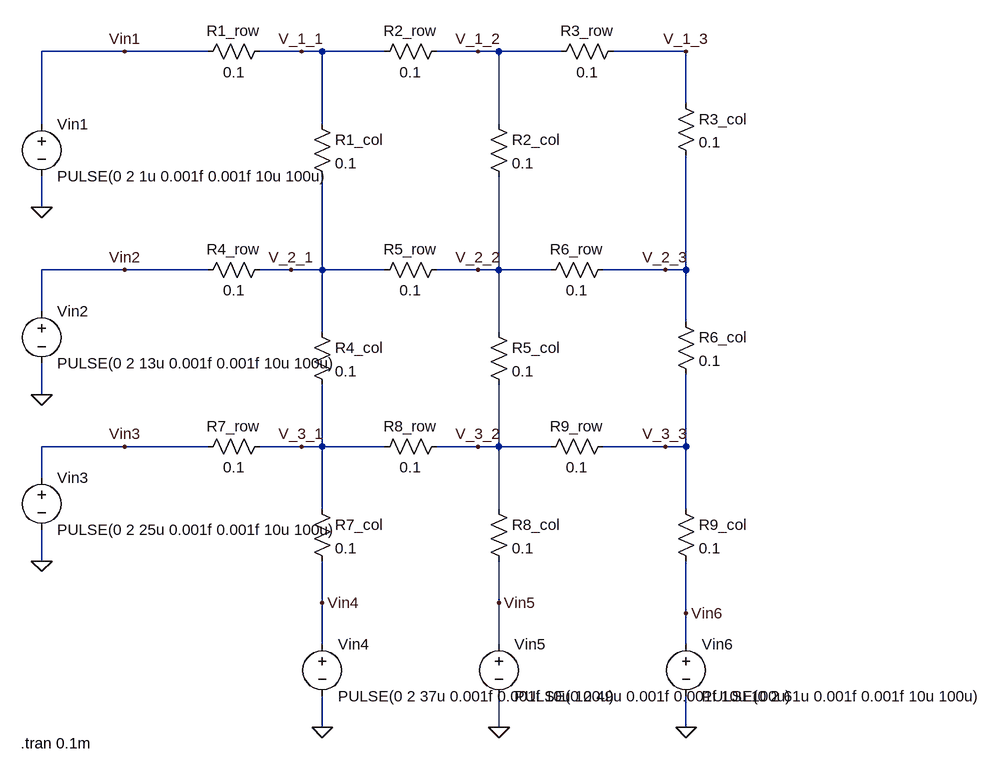
[diagram p0: schematic Memristor_modelling.asc]
Memristor_modelling.asc, the LTspice schematic file:
Version 4
SHEET 1 1428 920
WIRE 48 -160 -80 -160
WIRE 176 -160 48 -160
WIRE 320 -160 256 -160
WIRE 352 -160 320 -160
WIRE 448 -160 352 -160
WIRE 592 -160 528 -160
WIRE 624 -160 592 -160
WIRE 720 -160 624 -160
WIRE 912 -160 800 -160
WIRE 912 -80 912 -160
WIRE -80 -48 -80 -160
WIRE 352 -48 352 -160
WIRE 624 -48 624 -160
WIRE -80 80 -80 32
WIRE 48 176 -80 176
WIRE 176 176 48 176
WIRE 304 176 256 176
WIRE 352 176 352 32
WIRE 352 176 304 176
WIRE 448 176 352 176
WIRE 592 176 528 176
WIRE 624 176 624 32
WIRE 624 176 592 176
WIRE 704 176 624 176
WIRE 880 176 784 176
WIRE 912 176 912 0
WIRE 912 176 880 176
WIRE -80 240 -80 176
WIRE 912 256 912 176
WIRE 352 272 352 176
WIRE 624 272 624 176
WIRE -80 368 -80 320
WIRE 48 448 -80 448
WIRE 176 448 48 448
WIRE 320 448 256 448
WIRE 352 448 352 352
WIRE 352 448 320 448
WIRE 448 448 352 448
WIRE 592 448 528 448
WIRE 624 448 624 352
WIRE 624 448 592 448
WIRE 704 448 624 448
WIRE 880 448 784 448
WIRE 912 448 912 336
WIRE 912 448 880 448
WIRE -80 496 -80 448
WIRE 352 544 352 448
WIRE 624 544 624 448
WIRE 912 544 912 448
WIRE -80 624 -80 576
WIRE 352 688 352 624
WIRE 624 688 624 624
WIRE 912 704 912 624
WIRE 352 752 352 688
WIRE 624 752 624 688
WIRE 912 752 912 704
WIRE 352 880 352 832
WIRE 624 880 624 832
WIRE 912 880 912 832
FLAG -80 80 0
FLAG -80 368 0
FLAG -80 624 0
FLAG 352 880 0
FLAG 624 880 0
FLAG 912 880 0
FLAG 320 -160 V_1_1
FLAG 592 -160 V_1_2
FLAG 912 -160 V_1_3
FLAG 304 176 V_2_1
FLAG 592 176 V_2_2
FLAG 880 176 V_2_3
FLAG 320 448 V_3_1
FLAG 592 448 V_3_2
FLAG 880 448 V_3_3
FLAG 48 -160 Vin1
FLAG 48 176 Vin2
FLAG 48 448 Vin3
FLAG 352 688 Vin4
FLAG 624 688 Vin5
FLAG 912 704 Vin6
SYMBOL voltage -80 -64 R0
WINDOW 123 0 0 Left 2
WINDOW 39 0 0 Left 2
SYMATTR InstName Vin1
SYMATTR Value PULSE(0 2 1u 0.001f 0.001f 10u 100u)
SYMBOL voltage -80 224 R0
WINDOW 123 0 0 Left 2
WINDOW 39 0 0 Left 2
SYMATTR InstName Vin2
SYMATTR Value PULSE(0 2 13u 0.001f 0.001f 10u 100u)
SYMBOL voltage -80 480 R0
WINDOW 123 0 0 Left 2
WINDOW 39 0 0 Left 2
SYMATTR InstName Vin3
SYMATTR Value PULSE(0 2 25u 0.001f 0.001f 10u 100u)
SYMBOL res 160 -144 R270
WINDOW 0 32 56 VTop 2
WINDOW 3 0 56 VBottom 2
SYMATTR InstName R1_row
SYMATTR Value 0.1
SYMBOL res 432 -144 R270
WINDOW 0 32 56 VTop 2
WINDOW 3 0 56 VBottom 2
SYMATTR InstName R2_row
SYMATTR Value 0.1
SYMBOL res 704 -144 R270
WINDOW 0 32 56 VTop 2
WINDOW 3 0 56 VBottom 2
SYMATTR InstName R3_row
SYMATTR Value 0.1
SYMBOL res 160 192 R270
WINDOW 0 32 56 VTop 2
WINDOW 3 0 56 VBottom 2
SYMATTR InstName R4_row
SYMATTR Value 0.1
SYMBOL res 432 192 R270
WINDOW 0 32 56 VTop 2
WINDOW 3 0 56 VBottom 2
SYMATTR InstName R5_row
SYMATTR Value 0.1
SYMBOL res 688 192 R270
WINDOW 0 32 56 VTop 2
WINDOW 3 0 56 VBottom 2
SYMATTR InstName R6_row
SYMATTR Value 0.1
SYMBOL res 160 464 R270
WINDOW 0 32 56 VTop 2
WINDOW 3 0 56 VBottom 2
SYMATTR InstName R7_row
SYMATTR Value 0.1
SYMBOL res 432 464 R270
WINDOW 0 32 56 VTop 2
WINDOW 3 0 56 VBottom 2
SYMATTR InstName R8_row
SYMATTR Value 0.1
SYMBOL res 688 464 R270
WINDOW 0 32 56 VTop 2
WINDOW 3 0 56 VBottom 2
SYMATTR InstName R9_row
SYMATTR Value 0.1
SYMBOL res 336 -64 R0
SYMATTR InstName R1_col
SYMATTR Value 0.1
SYMBOL res 608 -64 R0
SYMATTR InstName R2_col
SYMATTR Value 0.1
SYMBOL res 336 256 R0
SYMATTR InstName R4_col
SYMATTR Value 0.1
SYMBOL res 608 256 R0
SYMATTR InstName R5_col
SYMATTR Value 0.1
SYMBOL res 896 240 R0
SYMATTR InstName R6_col
SYMATTR Value 0.1
SYMBOL res 896 -96 R0
SYMATTR InstName R3_col
SYMATTR Value 0.1
SYMBOL res 336 528 R0
SYMATTR InstName R7_col
SYMATTR Value 0.1
SYMBOL res 608 528 R0
SYMATTR InstName R8_col
SYMATTR Value 0.1
SYMBOL res 896 528 R0
SYMATTR InstName R9_col
SYMATTR Value 0.1
SYMBOL voltage 352 736 R0
WINDOW 123 0 0 Left 2
WINDOW 39 0 0 Left 2
SYMATTR InstName Vin4
SYMATTR Value PULSE(0 2 37u 0.001f 0.001f 10u 100u)
SYMBOL voltage 624 736 R0
WINDOW 123 0 0 Left 2
WINDOW 39 0 0 Left 2
SYMATTR InstName Vin5
SYMATTR Value PULSE(0 2 49u 0.001f 0.001f 10u 100u)
SYMBOL voltage 912 736 R0
WINDOW 123 0 0 Left 2
WINDOW 39 0 0 Left 2
SYMATTR InstName Vin6
SYMATTR Value PULSE(0 2 61u 0.001f 0.001f 10u 100u)
TEXT -112 904 Left 2 !.tran 0.1m

The netlist it stands for:
* Memristor_modelling.asc
Vin1 Vin1 0 PULSE(0 2 1u 0.001f 0.001f 10u 100u)
Vin2 Vin2 0 PULSE(0 2 13u 0.001f 0.001f 10u 100u)
Vin3 Vin3 0 PULSE(0 2 25u 0.001f 0.001f 10u 100u)
R1_row Vin1 V_1_1 0.1
R2_row V_1_1 V_1_2 0.1
R3_row V_1_2 V_1_3 0.1
R4_row Vin2 V_2_1 0.1
R5_row V_2_1 V_2_2 0.1
R6_row V_2_2 V_2_3 0.1
R7_row Vin3 V_3_1 0.1
R8_row V_3_1 V_3_2 0.1
R9_row V_3_2 V_3_3 0.1
R1_col V_1_1 V_2_1 0.1
R2_col V_1_2 V_2_2 0.1
R4_col V_2_1 V_3_1 0.1
R5_col V_2_2 V_3_2 0.1
R6_col V_2_3 V_3_3 0.1
R3_col V_1_3 V_2_3 0.1
R7_col V_3_1 Vin4 0.1
R8_col V_3_2 Vin5 0.1
R9_col V_3_3 Vin6 0.1
Vin4 Vin4 0 PULSE(0 2 37u 0.001f 0.001f 10u 100u)
Vin5 Vin5 0 PULSE(0 2 49u 0.001f 0.001f 10u 100u)
Vin6 Vin6 0 PULSE(0 2 61u 0.001f 0.001f 10u 100u)
.tran 0.1m
.backanno
.end